# EAGLE design MineSwipper Main_controller (EAGLE 8.5.1)

## Sheet 1 of 4: Arduino and Bluetooth
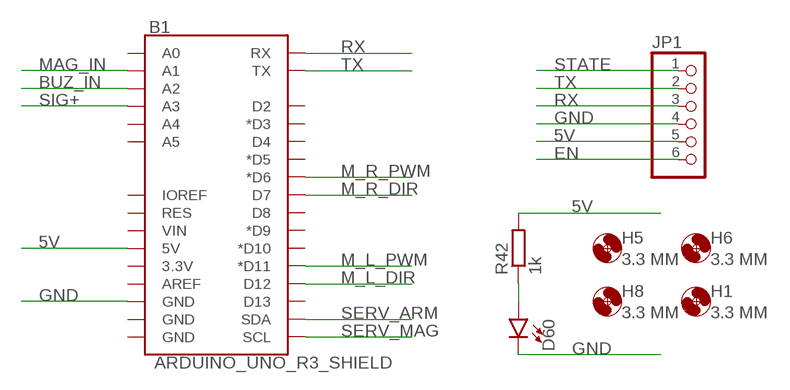
[diagram p0: schematic, sheet 1]

### Parts
B1  ARDUINO_UNO_R3_SHIELD  ARDUINO_UNO_R3_SHIELDUNO_R3_SHIELD_NOLABELS_LOCK  [UNO_R3_SHIELD_NOLABELS_LOCK]
D60  LED5MM  [LED_5MM]
H1  3.3 MM  MOUNT-HOLE3.3  [3,3]
H5  3.3 MM  MOUNT-HOLE3.3  [3,3]
H6  3.3 MM  MOUNT-HOLE3.3  [3,3]
H8  3.3 MM  MOUNT-HOLE3.3  [3,3]
JP1  PINHD-1X6  [1X06]
R42  1k  R-EU_0207/10  [0207/10]

### Nets
5V: B1.5V JP1.5 R42.2 ; also sheet 2
BUZ_IN: B1.A2 ; also sheet 4
EN: JP1.6
GND: B1.GND@2(GND) D60.K(C) JP1.4 ; also sheet 2,3,4
M_L_DIR: B1.D12 ; also sheet 2
M_L_PWM: B1.D11(*D11) ; also sheet 2
M_R_DIR: B1.D7 ; also sheet 2
M_R_PWM: B1.D6(*D6) ; also sheet 2
MAG_IN: B1.A1 ; also sheet 3
N$74: D60.A R42.1
RX: B1.RX JP1.3
SERV_ARM: B1.SDA ; also sheet 2
SERV_MAG: B1.SCL ; also sheet 2
SIG+: B1.A3 ; also sheet 2
STATE: JP1.1
TX: B1.TX JP1.2
Unconnected: B1.3.3V B1.A0 B1.A4 B1.A5 B1.AREF B1.D2 B1.D3(*D3) B1.D4 B1.D5(*D5) B1.D8 B1.D9(*D9) B1.D10(*D10) B1.D13 B1.GND@0(GND) B1.GND@1(GND) B1.IOREF B1.RES B1.VIN

## Sheet 2 of 4: Terminals
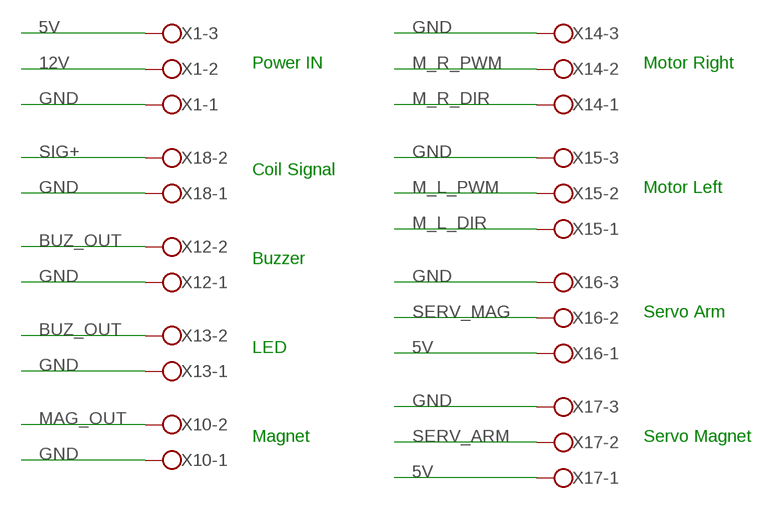
[diagram p1: schematic, sheet 2]

### Parts
X1  W237-103  [W237-103]
X10  W237-102  [W237-102]
X12  W237-102  [W237-102]
X13  W237-102  [W237-102]
X14  W237-103  [W237-103]
X15  W237-103  [W237-103]
X16  W237-103  [W237-103]
X17  W237-103  [W237-103]
X18  W237-102  [W237-102]

### Nets
5V: X1.3 X16.1 X17.1 ; also sheet 1
12V: X1.2 ; also sheet 3,4
BUZ_OUT: X12.2 X13.2 ; also sheet 4
GND: X1.1 X10.1 X12.1 X13.1 X14.3 X15.3 X16.3 X17.3 X18.1 ; also sheet 1,3,4
M_L_DIR: X15.1 ; also sheet 1
M_L_PWM: X15.2 ; also sheet 1
M_R_DIR: X14.1 ; also sheet 1
M_R_PWM: X14.2 ; also sheet 1
MAG_OUT: X10.2 ; also sheet 3
SERV_ARM: X17.2 ; also sheet 1
SERV_MAG: X16.2 ; also sheet 1
SIG+: X18.2 ; also sheet 1

### Notes on the sheet
- Power IN | Motor Right
- Coil Signal
- Motor Left
- Buzzer
- Servo Arm
- LED
- Magnet | Servo Magnet

## Sheet 3 of 4: Magnet ON/OFF
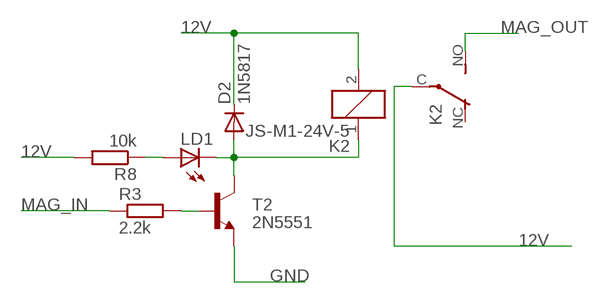
[diagram p2: schematic, sheet 3]

### Parts
D2  1N5817  1N4004  [DO41-10]
K2  JS-M1-24V-5  JS-M1-12V-5  [JS-M]
LD1  LED5MM  [LED5MM]
R3  2.2k  R-EU_0207/10  [0207/10]
R8  10k  R-EU_0207/10  [0207/10]
T2  2N5551  2N2222  [TO92-EBC-OVAL]

### Nets
12V: D2.C K2.2 K2.C(2:P) R8.2 ; also sheet 2,4
GND: T2.E ; also sheet 1,2,4
MAG_IN: R3.1 ; also sheet 1
MAG_OUT: K2.NO(2:S) ; also sheet 2
N$23: D2.A K2.1 LD1.K(C) T2.C
N$24: R3.2 T2.B
N$50: LD1.A R8.1
Unconnected: K2.NC(2:O)

## Sheet 4 of 4: BUZZER ON/OFF
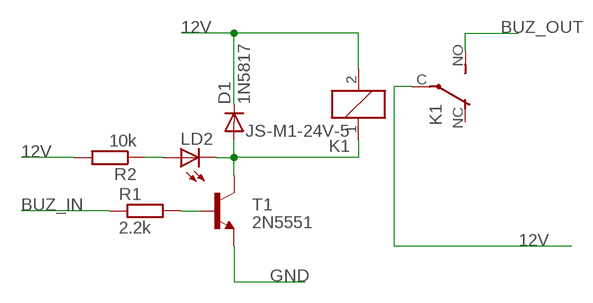
[diagram p3: schematic, sheet 4]

### Parts
D1  1N5817  1N4004  [DO41-10]
K1  JS-M1-24V-5  JS-M1-12V-5  [JS-M]
LD2  LED5MM  [LED5MM]
R1  2.2k  R-EU_0207/10  [0207/10]
R2  10k  R-EU_0207/10  [0207/10]
T1  2N5551  2N2222  [TO92-EBC-OVAL]

### Nets
12V: D1.C K1.2 K1.C(2:P) R2.2 ; also sheet 2,3
BUZ_IN: R1.1 ; also sheet 1
BUZ_OUT: K1.NO(2:S) ; also sheet 2
GND: T1.E ; also sheet 1,2,3
N$51: D1.A K1.1 LD2.K(C) T1.C
N$52: R1.2 T1.B
N$53: LD2.A R2.1
Unconnected: K1.NC(2:O)

## Library data of the parts
B1 = SparkFun-Boards:ARDUINO_UNO_R3_SHIELD: Arduino R3 Shield Footprint Shield form compatible with the Arduino Uno R3. SparkFun Products: MG2639 Cellular Shield <https://www.sparkfun.com/products/13120> MIDI Shield <https://www.sparkfun.com/products/12898> R3 Stackable Headers Kit <https://www.sparkfun.com/products/11417>
D1 D2 = adafruit:1N4004: DIODE General purpose 1N400x type rectifier (With bigger pads) http://www.ladyada.net/library/pcb/eaglelibrary.html
D60 = SparkFun-LED:LED: LED (Generic) Standard schematic elements and footprints for 5mm, 3mm, 1206, and 0603 sized LEDs. Generic LEDs with no color specified.
H1 H5 H6 H8 = holes:MOUNT-HOLE: MOUNTING HOLE with drill center marker
JP1 = adafruit:PINHD-1X6: PIN HEADER
K1 K2 = relay:JS-M1*: Automotive Ultra-Miniature Power Relay NAiS Source: http://www.mew-europe.com/.. en_ds_61211_0000.pdf; MF: FARNELL; MPN: JSM1-12V-5; OC_FARNELL: 910351; OC_NEWARK: 14J1764
LD1 LD2 = led:LED: LED OSRAM: - CHIPLED LG R971, LG N971, LY N971, LG Q971, LY Q971, LO R971, LY R971 LH N974, LH R974 LS Q976, LO Q976, LY Q976 LO Q996 - Hyper CHIPLED LW Q18S LB Q993, LB Q99A, LB R99A - SideLED LS A670, LO A670, LY A670, LG A670, LP A670 LB A673, LV A673, LT A673, LW A673 LH A674 LY A675 LS A676, LA A676, LO A676, LY A676, LW A676 LS A679, LY A679, LG A679 - Hyper Micro SIDELED® LS Y876, LA Y876, LO Y876, LY Y876 LT Y87S - SmartLED LW L88C, LW L88S LB L89C, LB L89S, LG L890 LS L89K, LO L89K, LY L89K LS L896, LA L896, LO L896, LY L896 - TOPLED LS T670, LO T670, LY T670, LG T670, LP T670 LSG T670, LSP T670, LSY T670, LOP T670, LYG T670 LG T671, LOG T671, LSG T671 LB T673, LV T673, LT T673, LW T673 LH T674 LS T676, LA T676, LO T676, LY T676, LB T676, LH T676, LSB T676, LW T676 LB T67C, LV T67C, LT T67C, LS T67K, LO T67K, LY T67K, LW E67C LS E67B, LA E67B, LO E67B, LY E67B, LB E67C, LV E67C, LT E67C LW T67C LS T679, LY T679, LG T679 LS T770, LO T770, LY T770, LG T770, LP T770 LB T773, LV T773, LT T773, LW T773 LH T774 LS E675, LA E675, LY E675, LS T675 LS T776, LA T776, LO T776, LY T776, LB T776 LHGB T686 LT T68C, LB T68C - Hyper Mini TOPLED® LB M676 - Mini TOPLED Santana® LG M470 LS M47K, LO M47K, LY M47K Source: http://www.osram.convergy.de/
R1-R3 R8 = rcl-2:R-EU_: RESISTOR, European symbol
R42 = rcl:R-EU_: RESISTOR, European symbol
T1 T2 = adafruit:2N2222: NPN TRANSISTOR Big oval pads
X1 X14-X17 = con-wago-500:W237-103: WAGO SCREW CLAMP; MPN: 237-103; OC_FARNELL: unknown; OC_NEWARK: 18M7116
X10 X12 X13 X18 = con-wago-500:W237-102: WAGO SCREW CLAMP; MPN: 237-102; OC_FARNELL: unknown; OC_NEWARK: 70K9898

## Board
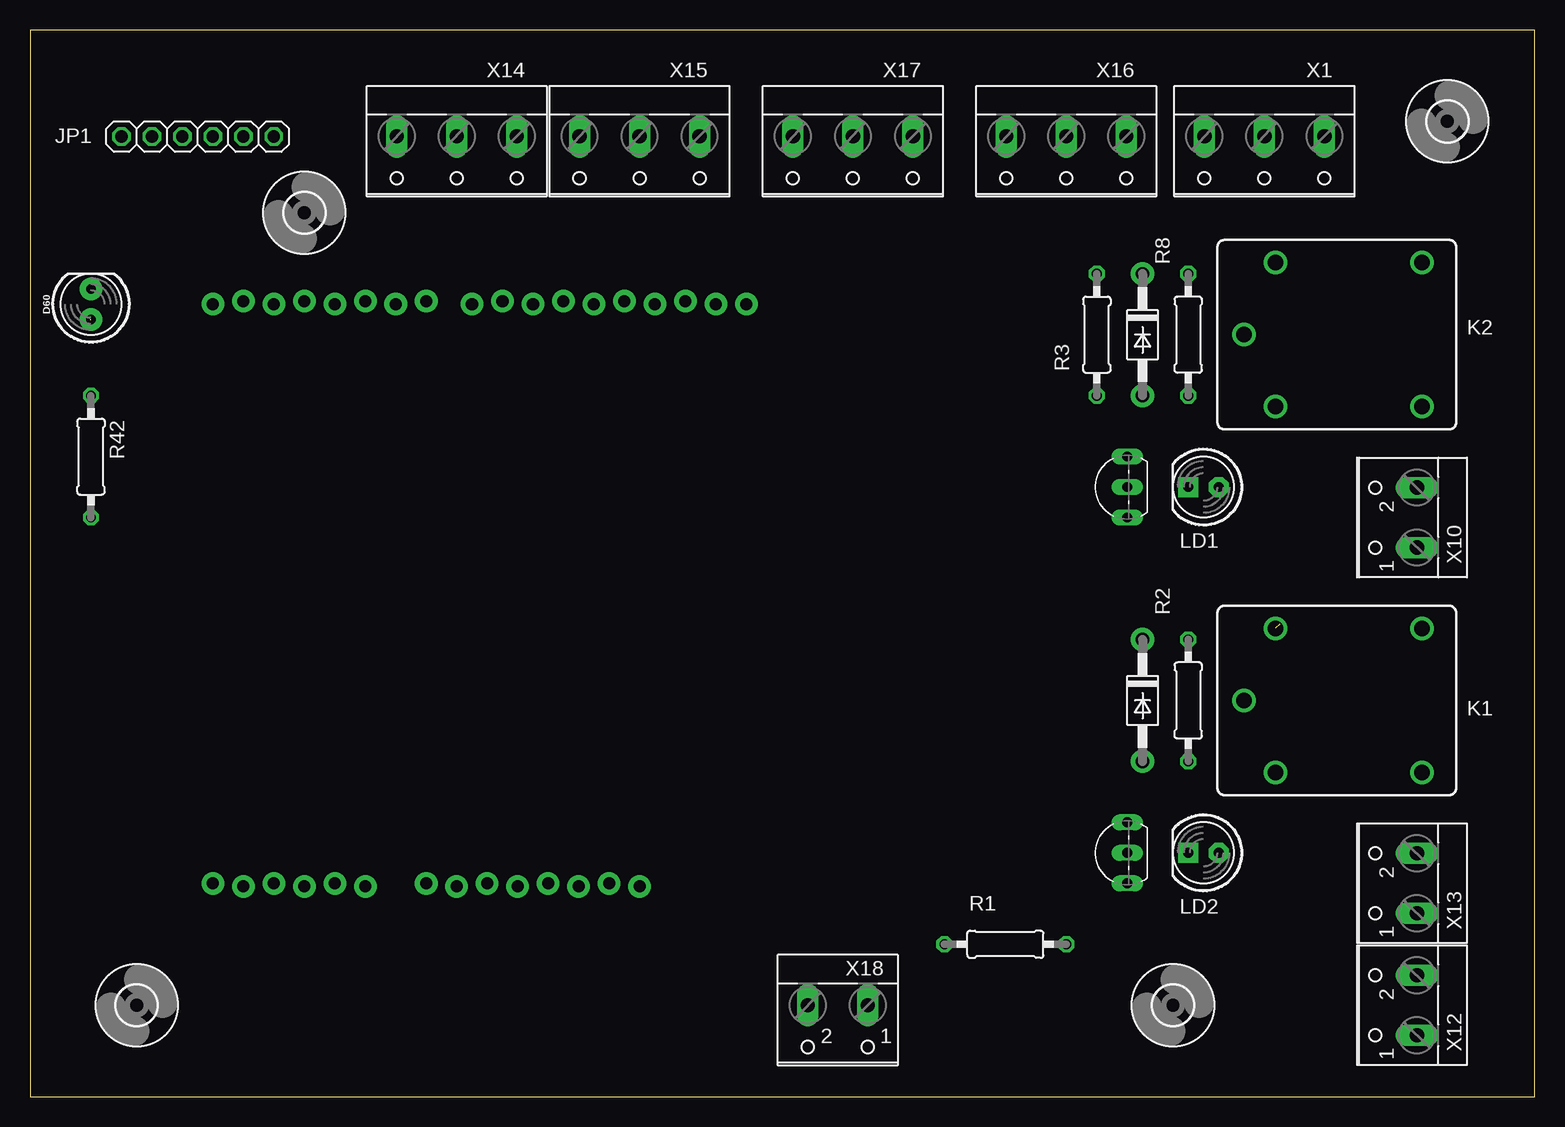
[diagram p4: board, top side]
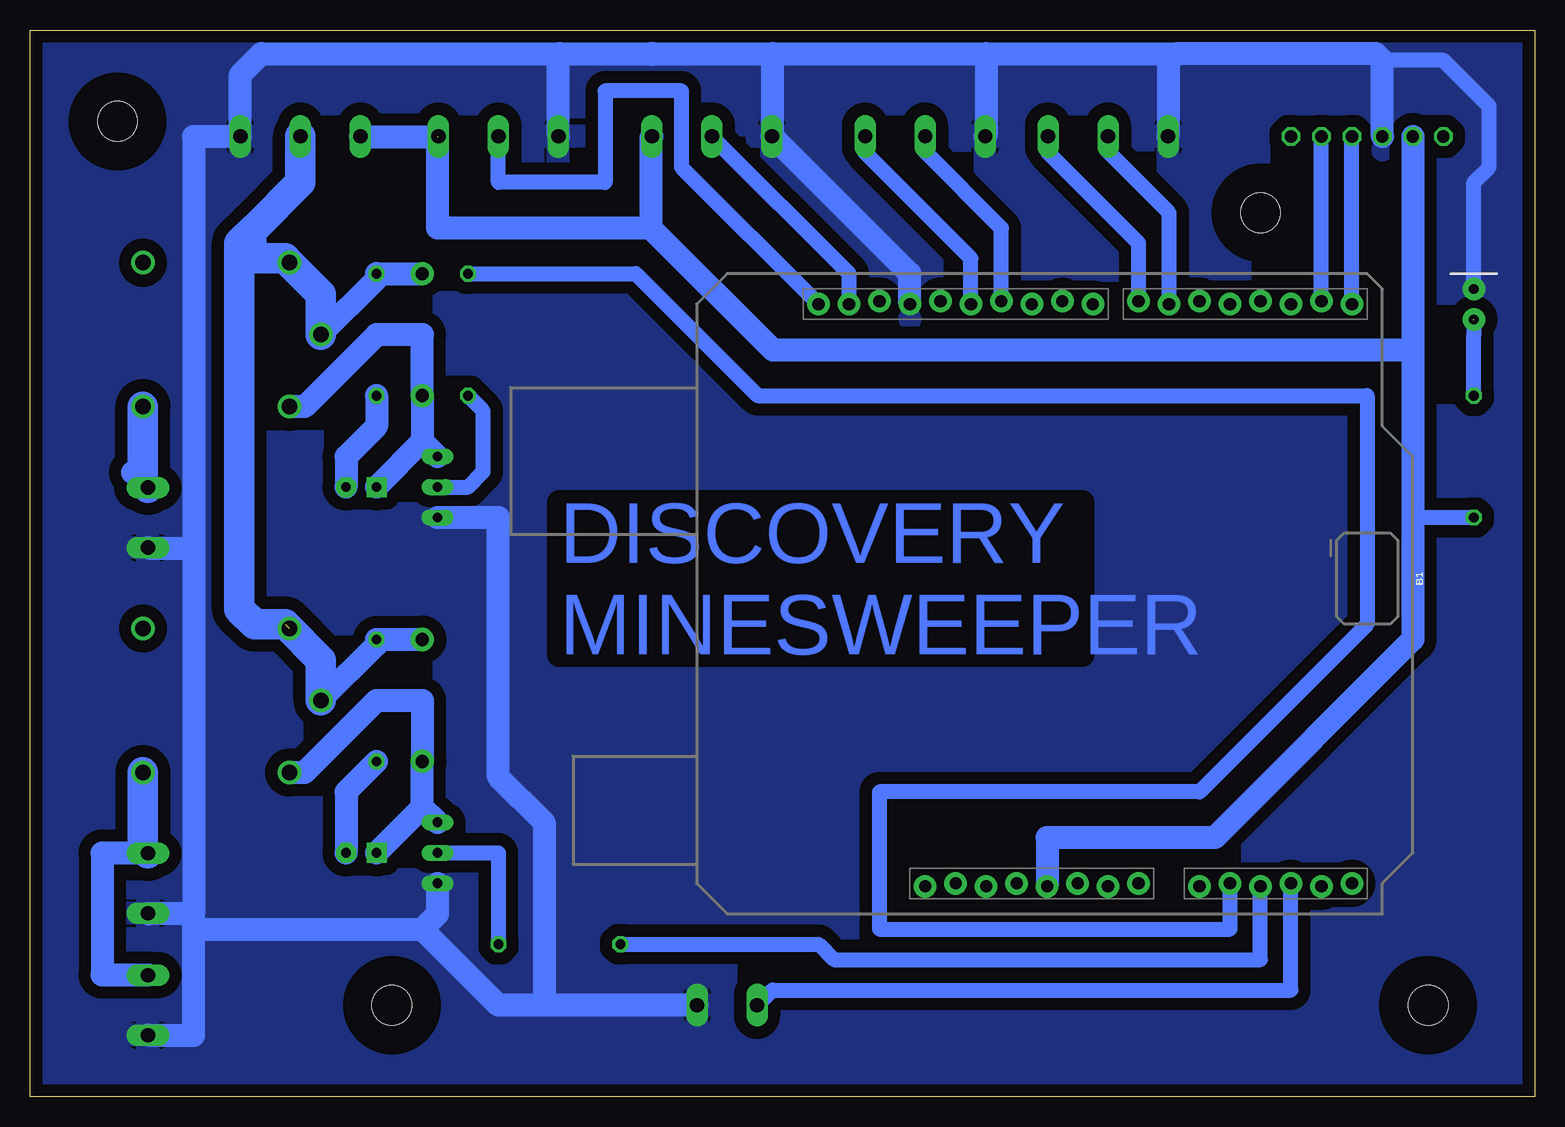
[diagram p5: board, bottom side, seen from below]

Size 125.4 x 88.89 mm. Coordinates in mm from the lower left corner, seen from the top.
Outline: 0,0 125.4,0 125.4,88.89 0,88.89 0,0
Copper layers (1*16): Top 0.035mm / dielectric 1.5mm / Bottom 0.035mm
Design rules "default *": minimum track width 6mil, minimum drill 0.35mm, track to track 40mil, track to pad 40mil, pad to pad 6mil, via to via 6mil, smd to smd 6mil, copper to edge 40mil, drill to drill 6mil, minimum pad ring 10mil, minimum via ring 8mil, stop-mask expansion 4mil, vias tented up to drill 0mil, thermal gap 10mil

### Footprints (pad centres in the part's own frame; a part is rotated, then mirrored left to right if it is on the bottom)
UNO_R3_SHIELD_NOLABELS_LOCK = drill 1.016 pad 1.88: 3.3V 24.13,-3.81; 5V 24.384,-1.27; A0 24.384,11.43; A1 24.13,13.97; A2 24.384,16.51; A3 24.13,19.05; A4 24.384,21.59; A5 24.13,24.13; AREF -24.384,-15.24; D2 -24.13,19.05; D3 -24.384,16.51; D4 -24.13,13.97; D5 -24.384,11.43; D6 -24.13,8.89; D7 -24.384,6.35; D8 -24.13,2.54; D9 -24.384,0; D10 -24.13,-2.54; D11 -24.384,-5.08; D12 -24.13,-7.62; D13 -24.384,-10.16; GND@0 24.13,1.27; GND@1 24.384,3.81; GND@2 -24.13,-12.7; IOREF 24.13,-8.89; NC 24.384,-11.43; RES 24.384,-6.35; RX -24.13,24.13; SCL -24.13,-20.32; SDA -24.13,-17.78; TX -24.384,21.59; VIN 24.13,6.35
DO41-10 = drill 1.118 pad 1.93: A 5.08,0; C -5.08,0
LED_5MM = drill 0.813 pad 1.88: A -1.27,0; K 1.27,0
3,3 = hole 3.3: 0,0
1X06 = drill 1.016 octagon: 1 -6.35,0; 2 -3.81,0; 3 -1.27,0; 4 1.27,0; 5 3.81,0; 6 6.35,0
JS-M = drill 1.3: 1 6.7,6; 2 6.7,-6; C 9.335,0; NC -5.5,-6; NO -5.5,6
LED5MM = drill 0.813 pad 1.676 octagon: A -1.27,0 | drill 0.813 pad 1.676 square: K 1.27,0
0207/10 = drill 0.813 octagon: 1 -5.08,0; 2 5.08,0
TO92-EBC-OVAL = drill 0.813 long: B 0,-1.27; C 2.54,-1.27; E -2.54,-1.27
W237-103 = drill 1.194 long: 1 -5,-1.29; 2 0,-1.29; 3 5,-1.29
W237-102 = drill 1.194 long: 1 -2.5,-1.27; 2 2.5,-1.27

### Placement (x,y rotation side)
B1  39.37,41.91 270 bottom
D1  92.71,33.02 270 top
D2  92.71,63.5 270 top
D60  5.08,66.04 90 top
H1  22.86,73.66 0 top
H5  8.89,7.62 0 top
H6  118.11,81.28 0 top
H8  95.25,7.62 0 top
JP1  13.97,80.01 180 top
K1  110.49,33.02 180 top
K2  110.49,63.5 180 top
LD1  97.79,50.8 180 top
LD2  97.79,20.32 180 top
R1  81.28,12.7 0 top
R2  96.52,33.02 90 top
R3  88.9,63.5 270 top
R8  96.52,63.5 90 top
R42  5.08,53.34 270 top
T1  90.17,20.32 90 top
T2  90.17,50.8 90 top
X1  102.87,78.74 180 top
X10  114.3,48.26 90 top
X12  114.3,7.62 90 top
X13  114.3,17.78 90 top
X14  35.56,78.74 180 top
X15  50.8,78.74 180 top
X16  86.36,78.74 180 top
X17  68.58,78.74 180 top
X18  67.31,6.35 180 top

### Tracks (layer width: path | path; a pad name or v marks a point on that pad's centre or on a via)
5V  (1 unrouted)
  Bottom 1.27: R42.2 10.16,48.26
  Bottom 1.905: X1.3 97.85,80.01 91.44,80.01 91.44,72.39 73.66,72.39 | X17.1 73.66,79.95 73.66,72.39 | JP1.5 10.16,62.23 | 10.16,62.23 10.16,48.26 10.16,38.1 26.67,21.59 40.64,21.59 B1.5V | 73.66,72.39 63.5,62.23 10.16,62.23
12V  (1 unrouted)
  Bottom 1.905: 104.14,69.85 K2.2 | K2.C 96.52,68.13 R8.2 D2.C | K1.C 96.52,37.66 R2.2 D1.C | 106.68,72.39 106.68,69.85
  Bottom 2.54: K1.C 101.16,36.38 104.14,39.37 106.68,39.37 107.95,40.64 107.95,71.12 106.68,72.39 102.87,76.2 X1.2 | 106.68,69.85 104.14,69.85 | K2.C 101.16,66.86 K2.2
BUZ_IN
  Bottom 1.27: R1.1 59.69,12.7 58.42,11.43 22.86,11.43 B1.A2
BUZ_OUT
  Bottom 1.905: X13.2 119.34,20.28 119.38,20.32 119.38,10.16 115.61,10.16 X12.2
  Bottom 2.54: K1.NO 115.99,20.7 X13.2
GND
  Bottom 1.27: D60.K 5.08,76.2 3.81,77.47 3.81,82.55 7.62,86.36 12.7,86.36
  Bottom 1.905: 111.76,45.72 111.76,15.24 | 111.76,15.24 115.53,15.24 X13.1 | X12.1 111.8,5.12 111.76,5.08 111.76,13.97 | 111.76,13.97 111.76,15.24 | X10.1 115.53,45.72 111.76,45.72 | 111.76,13.97 92.71,13.97 | 92.71,13.97 91.44,15.24 T1.E | 81.28,86.92 106.12,86.92 107.87,85.17 X1.1 107.89,80.01 111.76,80.01 111.76,45.72 | 81.28,86.92 73.66,86.92 73.58,86.84 73.5,86.92 63.5,86.92 | 63.5,86.92 45.72,86.92 | 45.72,86.92 45.72,80.11 X15.3 | 45.72,86.92 29.77,86.92 | 29.77,86.92 30.48,86.36 30.56,86.28 X14.3 | X17.3 63.5,80.11 | 63.5,80.11 63.5,86.92 | X16.3 81.36,86.84 81.28,86.92 | 82.55,7.62 82.55,22.86 86.36,26.67 86.36,48.26 T2.E | JP1.4 12.7,86.36 13.26,86.92 29.77,86.92 | B1.GND@2 52.07,68.58 63.5,80.01 63.5,80.11 | X18.1 82.55,7.62 | 82.55,7.62 86.36,7.62 92.71,13.97
  pour Bottom: 0,88.9 121.92,88.9 125.73,87.63 125.73,1.27 0,1.27
M_L_DIR
  Bottom 1.27: B1.D12 46.99,69.85 55.8,78.66 X15.1
M_L_PWM
  Bottom 1.27: B1.D11 44.45,72.39 50.8,78.74 X15.2
M_R_DIR
  Bottom 1.27: B1.D7 33.02,71.12 40.56,78.66 X14.1
M_R_PWM
  Bottom 1.27: B1.D6 30.48,73.66 35.56,78.74 X14.2
MAG_IN
  Bottom 1.27: R3.1 74.93,68.58 64.77,58.42 13.97,58.42 13.97,39.37 27.94,25.4 54.61,25.4 54.61,13.97 25.4,13.97 B1.A1
MAG_OUT
  Bottom 1.905: 116.84,52.03 X10.2
  Bottom 2.54: X10.2 115.99,51.18 K2.NO
N$23
  Bottom 1.905: K2.1 102.52,57.5 96.52,63.5 92.71,63.5 D2.A 92.71,54.61 | 92.71,54.61 T2.C | 92.71,54.61 LD1.K
N$24
  Bottom 1.27: T2.B 88.9,50.8 87.63,52.07 87.63,57.15 R3.2
N$50
  Bottom 1.905: R8.1 96.52,55.88 99.06,53.34 LD1.A
N$51
  Bottom 1.905: K1.1 102.52,27.02 96.52,33.02 92.71,33.02 D1.A 92.71,24.13 | LD2.K 92.71,24.13 | T1.C 92.71,24.13
N$52
  Bottom 1.27: T1.B 86.36,20.32 R1.2
N$53
  Bottom 1.905: R2.1 99.06,25.4 LD2.A
N$74  (1 unrouted)
  Bottom 1.27: R42.1 5.08,63.5 5.08,64.72
RX
  Bottom 1.27: B1.RX JP1.3
SERV_ARM
  Bottom 0.813: 57.15,68.58 58.42,69.85
  Bottom 1.27: B1.SDA 57.15,68.58 68.58,80.01 X17.2
SERV_MAG
  Bottom 1.27: B1.SCL 71.12,77.47 71.12,83.82 77.47,83.82 77.47,76.2 86.36,76.2 X16.2
SIG+
  Bottom 1.27: X18.2 63.54,8.89 20.32,8.89 B1.A3
TX
  Bottom 1.27: B1.TX JP1.2

### Text on the board
Bottom: DISCOVERY / MINESWEEPER
tDocu: BLUETOOTH | G | P | D | G | P | D | G | S | 5 | G | S | 5 | 5 | 12 | G | M Right | M Left | S Arm | S Mag | - | + | MAGNET | DISCOVERY / MINESWEEPER | POWER LED | - | + | - | + | COIL SIG+ | COIL SIG- | LED | BUZZER